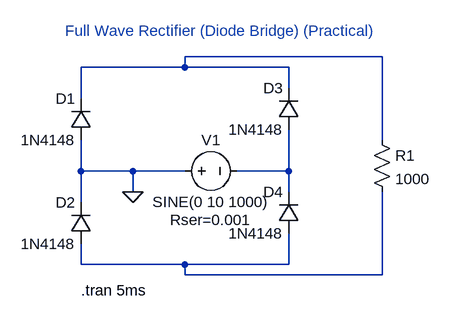
[diagram p0: schematic Assignment 4b (ii).asc]
Assignment 4b (ii).asc, the LTspice schematic file:
Version 4
SHEET 1 880 680
WIRE 448 64 144 64
WIRE 144 80 144 64
WIRE 144 80 -16 80
WIRE 304 80 144 80
WIRE 304 112 304 80
WIRE -16 128 -16 80
WIRE 448 192 448 64
WIRE -16 240 -16 192
WIRE 64 240 -16 240
WIRE 144 240 64 240
WIRE 304 240 304 176
WIRE 304 240 224 240
WIRE 64 272 64 240
WIRE 304 272 304 240
WIRE -16 288 -16 240
WIRE -16 384 -16 352
WIRE 144 384 -16 384
WIRE 304 384 304 336
WIRE 304 384 144 384
WIRE 144 400 144 384
WIRE 448 400 448 272
WIRE 448 400 144 400
FLAG 64 272 0
SYMBOL voltage 128 240 R270
WINDOW 0 32 56 VTop 2
WINDOW 3 -32 56 VBottom 2
WINDOW 123 0 0 Left 2
WINDOW 39 -60 56 VBottom 2
SYMATTR InstName V1
SYMATTR Value SINE(0 10 1000)
SYMATTR SpiceLine Rser=0.001
SYMBOL diode 0 192 R180
WINDOW 0 24 64 Left 2
WINDOW 3 24 0 Left 2
SYMATTR InstName D1
SYMATTR Value 1N4148
SYMBOL diode 0 352 R180
WINDOW 0 24 64 Left 2
WINDOW 3 24 0 Left 2
SYMATTR InstName D2
SYMATTR Value 1N4148
SYMBOL diode 320 176 R180
WINDOW 0 24 64 Left 2
WINDOW 3 24 0 Left 2
SYMATTR InstName D3
SYMATTR Value 1N4148
SYMBOL diode 320 336 R180
WINDOW 0 24 64 Left 2
WINDOW 3 24 0 Left 2
SYMATTR InstName D4
SYMATTR Value 1N4148
SYMBOL res 432 176 R0
SYMATTR InstName R1
SYMATTR Value 1000
TEXT -16 424 Left 2 !.tran 5ms
TEXT -40 24 Left 2 ;Full Wave Rectifier (Diode Bridge) (Practical)

The netlist it stands for:
* Assignment 4b (ii).asc
V1 0 N002 SINE(0 10 1000) Rser=0.001
D1 0 N001 1N4148
D2 N003 0 1N4148
D3 N002 N001 1N4148
D4 N003 N002 1N4148
R1 N001 N003 1000
.model D D
.lib standard.dio
.tran 5ms
* Full Wave Rectifier (Diode Bridge) (Practical)
.backanno
.end